# Altium schematic sheet SPI Isolator.SchDoc
size 420 x 297 mm; SheetNumber: 1; SheetTotal: 1
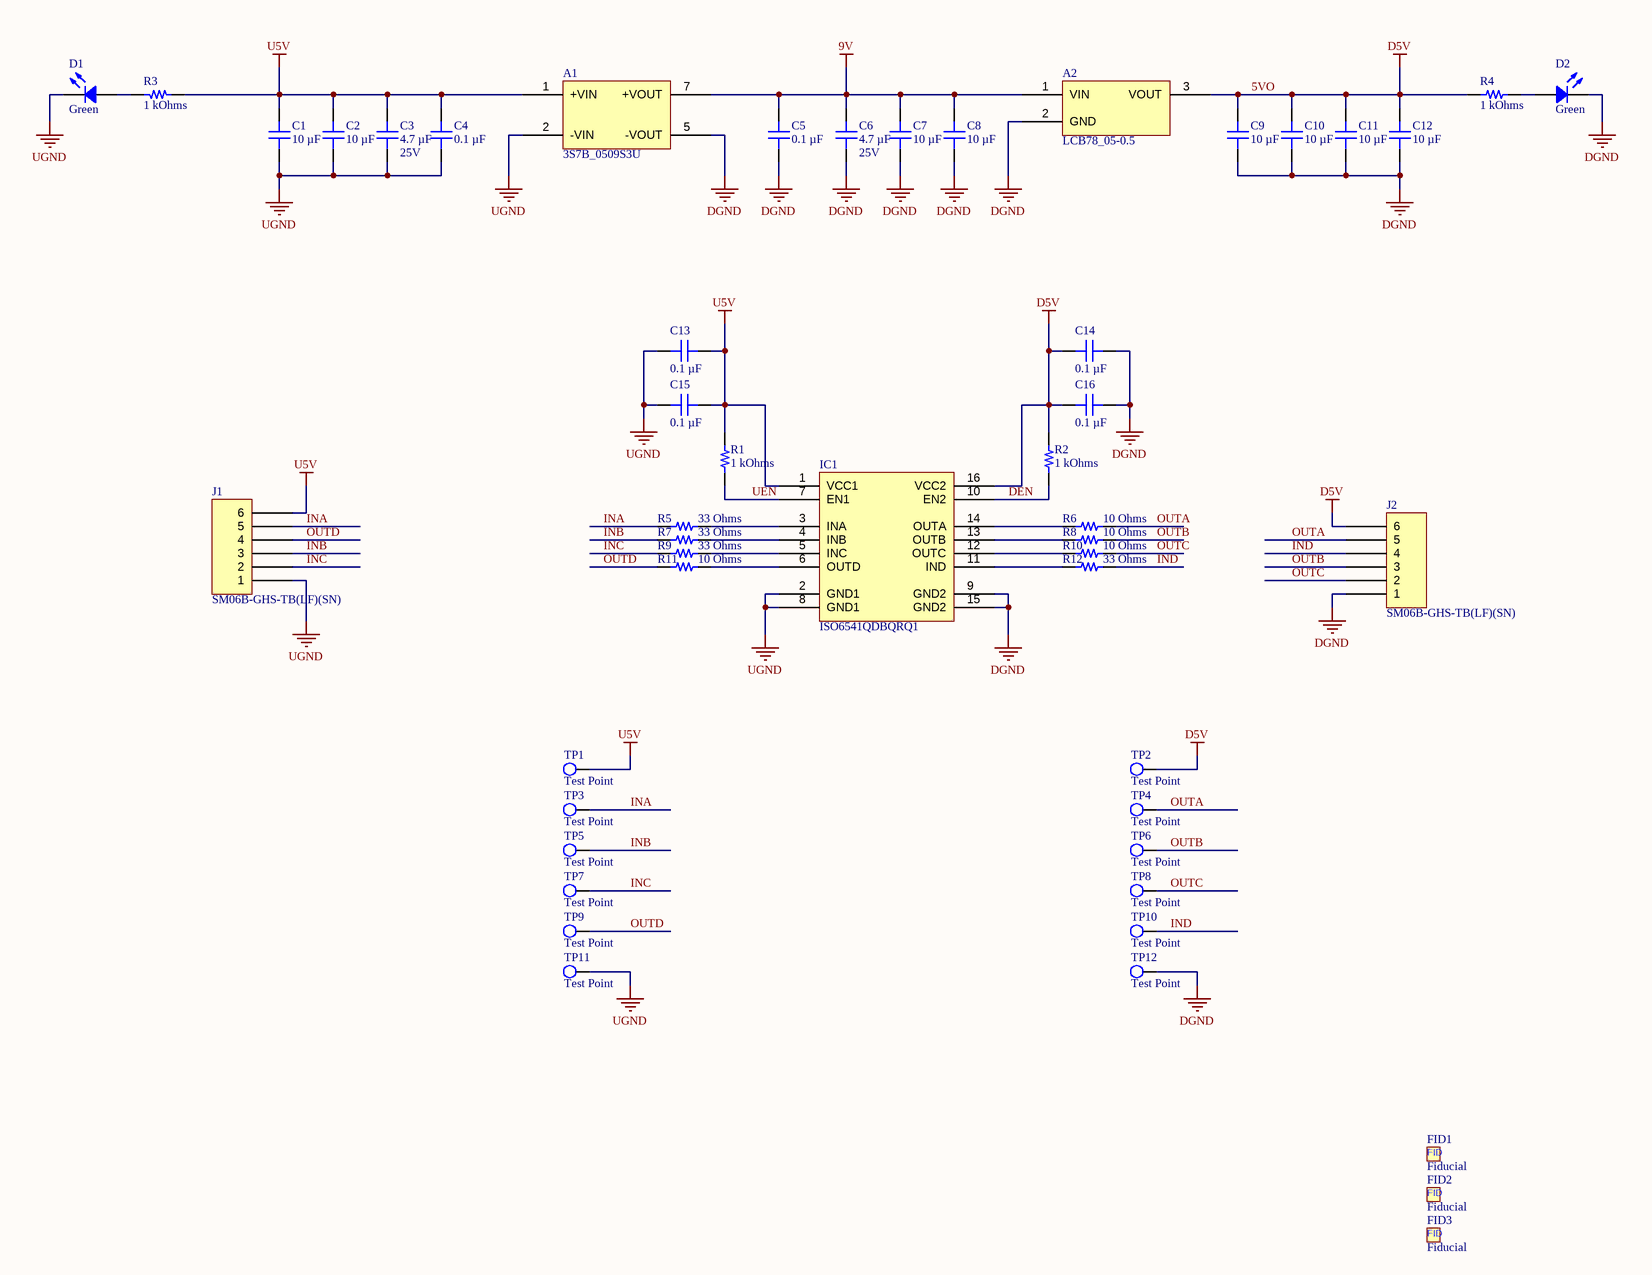
[diagram p0: SPI Isolator.SchDoc]

## Parts
A1  3S7B_0509S3U  [GAPTEC 3S7B_3U SINGLE]
A2  LCB78_05-0.5  [GAPTEC LCB78_0.5]
C1  10 µF  [CAP 1206_3216 - 0.8MM]
C2  10 µF  [CAP 1206_3216 - 0.8MM]
C3  Voltage - Rated: 25V  [MURATA GRM188 0603_1608]  (hidden comment: 4.7 µF)
C4  0.1 µF  [CAP 0603_1608]
C5  0.1 µF  [CAP 0603_1608]
C6  Voltage - Rated: 25V  [MURATA GRM188 0603_1608]  (hidden comment: 4.7 µF)
C7  10 µF  [CAP 1206_3216 - 0.8MM]
C8  10 µF  [CAP 1206_3216 - 0.8MM]
C9  10 µF  [CAP 1206_3216 - 0.8MM]
C10  10 µF  [CAP 1206_3216 - 0.8MM]
C11  10 µF  [CAP 1206_3216 - 0.8MM]
C12  10 µF  [CAP 1206_3216 - 0.8MM]
C13  0.1 µF  [CAP 0603_1608]
C14  0.1 µF  [CAP 0603_1608]
C15  0.1 µF  [CAP 0603_1608]
C16  0.1 µF  [CAP 0603_1608]
D1  Green  [LED 0603_1608 GREEN]
D2  Green  [LED 0603_1608 GREEN]
FID1  Fiducial  [Fiducial-1mm]
FID2  Fiducial  [Fiducial-1mm]
FID3  Fiducial  [Fiducial-1mm]
IC1  ISO6541QDBQRQ1  [TI SSOP-16 DBQ0016A]
J1  SM06B-GHS-TB(LF)(SN)  [JST SM06B-GHS-TB]
J2  SM06B-GHS-TB(LF)(SN)  [JST SM06B-GHS-TB]
R1  1 kOhms  [YAGEO RES 0402_1005]
R2  1 kOhms  [YAGEO RES 0402_1005]
R3  1 kOhms  [YAGEO RES 0402_1005]
R4  1 kOhms  [YAGEO RES 0402_1005]
R5  33 Ohms  [YAGEO RES 0402_1005]
R6  10 Ohms  [YAGEO RES 0402_1005]
R7  33 Ohms  [YAGEO RES 0402_1005]
R8  10 Ohms  [YAGEO RES 0402_1005]
R9  33 Ohms  [YAGEO RES 0402_1005]
R10  10 Ohms  [YAGEO RES 0402_1005]
R11  10 Ohms  [YAGEO RES 0402_1005]
R12  33 Ohms  [YAGEO RES 0402_1005]
TP1  Test Point  [TestPoint-1.5mm]  (no BOM)
TP2  Test Point  [TestPoint-1.5mm]  (no BOM)
TP3  Test Point  [TestPoint-1.5mm]  (no BOM)
TP4  Test Point  [TestPoint-1.5mm]  (no BOM)
TP5  Test Point  [TestPoint-1.5mm]  (no BOM)
TP6  Test Point  [TestPoint-1.5mm]  (no BOM)
TP7  Test Point  [TestPoint-1.5mm]  (no BOM)
TP8  Test Point  [TestPoint-1.5mm]  (no BOM)
TP9  Test Point  [TestPoint-1.5mm]  (no BOM)
TP10  Test Point  [TestPoint-1.5mm]  (no BOM)
TP11  Test Point  [TestPoint-1.5mm]  (no BOM)
TP12  Test Point  [TestPoint-1.5mm]  (no BOM)

## Nets
5VO: A2.3(VOUT) C9.2 C10.2 C11.2 C12.2 C14.2 C16.2 IC1.16(VCC2) J2.6 R2.1 R4.1 TP2.1(TP)  [also labelled D5V]
9V: A1.7(+VOUT) A2.1(VIN) C5.2 C6.2 C7.2 C8.2
DGND: A1.5(-VOUT) A2.2(GND) C5.1 C6.1 C7.1 C8.1 C9.1 C10.1 C11.1 C12.1 C14.1 C16.1 D2.2 IC1.9(GND2) IC1.15(GND2) J2.1 TP12.1(TP)
U5V: A1.1(+VIN) C1.2 C2.2 C3.2 C4.2 C13.1 C15.1 IC1.1(VCC1) J1.6 R1.1 R3.1 TP1.1(TP)
UGND: A1.2(-VIN) C1.1 C2.1 C3.1 C4.1 C13.2 C15.2 D1.2 IC1.2(GND1) IC1.8(GND1) J1.1 TP11.1(TP)
DEN: IC1.10(EN2) R2.2
INA: J1.5 R5.2 TP3.1(TP)
INB: J1.3 R7.2 TP5.1(TP)
INC: J1.2 R9.2 TP7.1(TP)
IND: J2.4 R12.1 TP10.1(TP)
OUTA: J2.5 R6.2 TP4.1(TP)
OUTB: J2.3 R8.2 TP6.1(TP)
OUTC: J2.2 R10.2 TP8.1(TP)
OUTD: J1.4 R11.1 TP9.1(TP)
UEN: IC1.7(EN1) R1.2
NetD1_1: D1.1 R3.2
NetD2_1: D2.1 R4.2
NetIC1_3: IC1.3(INA) R5.1
NetIC1_4: IC1.4(INB) R7.1
NetIC1_5: IC1.5(INC) R9.1
NetIC1_6: IC1.6(OUTD) R11.2
NetIC1_11: IC1.11(IND) R12.2
NetIC1_12: IC1.12(OUTC) R10.1
NetIC1_13: IC1.13(OUTB) R8.1
NetIC1_14: IC1.14(OUTA) R6.1

## Notes on the sheet
- THIS DOCUMENT AND THE DATA DISCLOSED HEREIN OR
- HEREWITH IS THE PROPERTY OF ORIGINAL CIRCUIT LIMITED
- DWG NO:
- REVISION
- DESCRIPTION
- DATE
- APPROVED
- AND IS STRICTLY CONFIDENTIAL.
- DO NOT DISTRIBUTE.
- DOC NO.
- ORIGINAL CIRCUIT LIMITED
- Company Number: 12070904
- TITLE
- VAT Number: GB345196095
- SIZE
- FILE
- A3
- PROJECT
- CHECKED
- SHEET
- OF
- REV
- (in symbol CMP-002-000000-1) FID

## Library data of the parts
A1 = 3S7B_0509S3U: DC-DC; Manufacturer: GAPTEC Electronic; Current - Output (Max): 333mA; Efficiency: 84%; Number of Outputs: 1; Power (Watts): 3 W; Voltage - Input (Max): 5.5V; Voltage - Input (Min): 4.5V; Voltage - Isolation: 3 kV; Voltage - Output 1: 9V; Part Number: 3S7B_0509S3U; Applications: ITE (Commercial); ComponentLink1Description: Datasheet; ComponentLink1URL: https://gaptec-electronic.com/datenblaetter/3S7B_3U.pdf; ComponentLink2Description: DigiKey Link; ComponentLink2URL: https://www.digikey.com/en/products/detail/gaptec-electronic/3S7B-0509S3U/13692545; LastUpdated: 01/09/2023 20:51:51; Lifecycle Status: Active; Minimum Order: 1; Mounting Type: Through Hole; Operating Temperature: -40°C ~ 85°C; Packaging: Tube; PartId: 72; Part Status: Active; Price: 5.05; Series: 3S7B_3U (3W); Size / Dimension: 0.77" L x 0.28" W x 0.39" H (19.6mm x 7.0mm x 10.0mm); Supplier 1: DigiKey; Supplier Part Number 1: 3182-3S7B_0509S3U-ND; Type: Isolated Module
A2 = LCB78_05-0.5: DC-DC POL; Manufacturer: GAPTEC Electronic; Current - Output (Max): 500mA; Efficiency: 95%; Number of Outputs: 1; Power (Watts): 2.5 W; Voltage - Input (Max): 55V; Voltage - Input (Min): 6.5V; Voltage - Output 1: 5V; Part Number: LCB78_05-0.5; Applications: ITE (Commercial); ComponentLink1Description: Datasheet; ComponentLink1URL: https://gaptec-electronic.com/datenblaetter/LCB78_0.5.pdf; ComponentLink2Description: DigiKey Link; ComponentLink2URL: https://www.digikey.com/en/products/detail/gaptec-electronic/LCB78-05-0-5/13691990; LastUpdated: 04/09/2023 17:37:46; Lifecycle Status: Active; Minimum Order: 1; Mounting Type: Through Hole; Operating Temperature: -40°C ~ 85°C (With Derating); Packaging: Tube; PartId: 87; Part Status: Active; Price: 5.66; Series: LCB78_0.5; Size / Dimension: 0.46" L x 0.24" W x 0.40" H (11.6mm x 6.0mm x 10.2mm); Supplier 1: DigiKey; Supplier Part Number 1: 3182-LCB78_05-0.5-ND; Type: Non-Isolated PoL Module
C1 C2 C7-C12 = CL31B106KAHNNNE: CAP CER 10UF 25V X7R 1206; manufacturer: Samsung Electro-Mechanics; Tolerance: ±10%; Part Number: CL31B106KAHNNNE; Value: 10 µF; Applications: General Purpose; Capacitance: 10 µF; componentlink1description: Datasheet; componentlink1url: http://www.samsungsem.com/kr/support/product-search/mlcc/CL31B106KAHNNNE.jsp; componentlink2description: DigiKey Link; componentlink2url: https://www.digikey.com/en/products/detail/samsung-electro-mechanics/CL31B106KAHNNNE/3887462; Device Package: 1206 (3216 Metric); lastupdated: 03/09/2023 19:14:37; Lifecycle Status: Active; Minimum Order: 1; Mounting Type: Surface Mount, MLCC; Operating Temperature: -55°C ~ 125°C; Package / Case: 1206 (3216 Metric); packaging: TapeAndReel; partid: 40754; Part Status: Active; price: 0.03; series: CL; Size / Dimension: 0.126" L x 0.063" W (3.20mm x 1.60mm); Supplier 1: DigiKey; Supplier Part Number 1: 1276-1804-1-ND; Temperature Coefficient: X7R; Thickness (Max): 0.071" (1.80mm); Voltage - Rated: 25V
C3 C6 = GRM188R61E475KE11D: CAP CER 4.7UF 25V X5R 0603; manufacturer: Murata Electronics; Tolerance: ±10%; Part Number: GRM188R61E475KE11D; Value: 4.7 µF; Applications: General Purpose; Capacitance: 4.7 µF; componentlink1description: Datasheet; componentlink1url: https://www.murata.com/~/media/webrenewal/support/library/catalog/products/capacitor/mlcc/c02e.ashx?la=en-us; componentlink2description: DigiKey Link; componentlink2url: https://www.digikey.com/en/products/detail/murata-electronics/GRM188R61E475KE11D/3900465; Device Package: 0603 (1608 Metric); lastupdated: 20/07/2024 00:23:22; Lifecycle Status: Active; Minimum Order: 1; Mounting Type: Surface Mount, MLCC; Operating Temperature: -55°C ~ 85°C; Package / Case: 0603 (1608 Metric); packaging: TapeAndReel; partid: 2387; Part Status: Active; price: 0.04; series: GRM; Size / Dimension: 0.063" L x 0.031" W (1.60mm x 0.80mm); Supplier 1: DigiKey; Supplier Part Number 1: 490-7203-1-ND; Temperature Coefficient: X5R; Thickness (Max): 0.037" (0.95mm)
C4 C5 C13-C16 = CL10B104KB8NNNC: CAP CER 0.1UF 50V X7R 0603; manufacturer: Samsung Electro-Mechanics; Tolerance: ±10%; Part Number: CL10B104KB8NNNC; Value: 0.1 µF; Applications: General Purpose; Capacitance: 0.1 µF; componentlink1description: Datasheet; componentlink1url: http://www.samsungsem.com/kr/support/product-search/mlcc/CL10B104KB8NNNC.jsp; componentlink2description: DigiKey Link; componentlink2url: https://www.digikey.com/en/products/detail/samsung-electro-mechanics/CL10B104KB8NNNC/3886658; Device Package: 0603 (1608 Metric); lastupdated: 20/08/2023 19:09:00; Lifecycle Status: Active; Minimum Order: 1; Mounting Type: Surface Mount, MLCC; Operating Temperature: -55°C ~ 125°C; Package / Case: 0603 (1608 Metric); packaging: TapeAndReel; partid: 9788; Part Status: Active; price: 0.01; series: CL; Size / Dimension: 0.063" L x 0.031" W (1.60mm x 0.80mm); Supplier 1: DigiKey; Supplier Part Number 1: 1276-1000-1-ND; Temperature Coefficient: X7R; Thickness (Max): 0.035" (0.90mm); Voltage - Rated: 50V
D1 D2 = LG Q976.01-MGNI-35-1: LED GREEN CLEAR 0603 SMD; Manufacturer: ams-OSRAM USA Inc.; Current - Test: 20mA; Lens Color: Colorless; Lens Size: 1.10mm x 0.80mm; Lens Style: Rectangle with Flat Top; Millicandela Rating: 31.5mcd; Viewing Angle: 140°; Voltage - Forward (Vf) (Typ): 2V; Wavelength - Dominant: 574nm; Part Number: LG Q976.01-MGNI-35-1; Color: Green; ComponentLink2Description: DigiKey Link; ComponentLink2URL: https://www.digikey.com/en/products/detail/ams-osram-usa-inc/LG-Q976-01-MGNI-35-1/21556493; Device Package: 0603 (1608 Metric); Height (Max): 0.75mm; LastUpdated: 03/06/2024 19:58:39; Lens Transparency: Clear; Lifecycle Status: Active; Minimum Order: 1; Mounting Type: Surface Mount; Package / Case: 0603 (1608 Metric); Packaging: TapeAndReel; PartId: 1447; Price: 0.02; Series: LO Q976.01; Size / Dimension: 1.60mm L x 0.80mm W; Supplier 1: DigiKey; Supplier Part Number 1: 475-LGQ976.01-MGNI-35-1CT-ND; Supplier Device Package: 0603; Value: Green; Wavelength - Peak: 574nm
FID1-FID3 = CMP-002-000000-1: Design Item ID: Fiducial; Component Type: Standard; Source: Fiducial.SchLib; Pin Count: 0
IC1 = ISO6541QDBQRQ1: AUTOMOTIVE, 100-V ISOLATION; Manufacturer: Texas Instruments; Channel Type: Unidirectional; Common Mode Transient Immunity (Min): 100kV/µs; Data Rate: 50Mbps; Inputs - Side 1/Side 2: 3/1; Isolated Power: Yes; Number of Channels: 4; Propagation Delay tpLH / tpHL (Max): 18ns, 18ns; Pulse Width Distortion (Max): 7ns; Rise / Fall Time (Typ): 2.6ns, 2.6ns; Voltage - Isolation: 707Vrms; Voltage - Supply: 1.71V ~ 1.89V, 2.25V ~ 5.5V; Part Number: ISO6541QDBQRQ1; ComponentLink1Description: Datasheet; ComponentLink1URL: https://www.ti.com/lit/ds/symlink/iso6521-q1.pdf?ts=1748606133465&ref_url=https%253A%252F%252Fwww.ti.com%252Fproduct%252FISO6521-Q1%252Fpart-details%252FISO6521FQDRQ1; ComponentLink2Description: DigiKey Link; ComponentLink2URL: https://www.digikey.com/en/products/detail/texas-instruments/ISO6541QDBQRQ1/26692274; LastUpdated: 15/07/2025 15:42:45; Lifecycle Status: Active; Minimum Order: 1; Mounting Type: Surface Mount; Operating Temperature: -40°C ~ 125°C; Packaging: TapeAndReel; PartId: 50; Price: 0.70; Series: -; Supplier 1: DigiKey; Supplier Part Number 1: 296-ISO6541QDBQRQ1CT-ND; Supplier Device Package: 16-SSOP; Technology: Capacitive Coupling; Type: CAN, SPI
J1 J2 = SM06B-GHS-TB(LF)(SN): CONN HEADER SMD R/A 6POS 1.25MM; Manufacturer: JST Sales America Inc.; Current Rating (Amps): 1A; Material Flammability Rating: UL94 V-0; Number of Positions: 6; Number of Positions Loaded: All; Pitch - Mating: 0.049" (1.25mm); Shrouding: Shrouded - 4 Wall; Style: Board to Cable/Wire; Voltage Rating: 50V; Part Number: SM06B-GHS-TB(LF)(SN); ComponentLink1Description: Datasheet; ComponentLink1URL: http://www.jst-mfg.com/product/pdf/eng/eGH.pdf; ComponentLink2Description: DigiKey Link; ComponentLink2URL: http://digikey.com/product-detail/en/jst-sales-america-inc/SM06B-GHS-TB-LF-SN/455-1568-1-ND/807836; Connector Type: Header; Contact Finish - Mating: Tin; Contact Finish - Post: Tin; Contact Material: Phosphor Bronze; Contact Shape: Rectangular; Contact Type: Outer Shroud Contact; Fastening Type: Locking Ramp; Features: Solder Retention; Insulation Color: Natural; Insulation Height: 0.167" (4.25mm); Insulation Material: Polyamide (PA9T), Nylon 9T; LastUpdated: 12/01/2020 23:38:11; Lifecycle Status: Active; Minimum Order: 1; Mounting Type: Surface Mount, Right Angle; Number of Rows: 1; Operating Temperature: -25°C ~ 85°C; Packaging: TapeAndReel; PartId: 57; Part Status: Active; Price: 0.25; Series: GH; Supplier 1: DigiKey; Supplier Part Number 1: 455-1568-1-ND; Termination: Solder
R1-R4 = RC0402FR-071KP: RES 1K OHM 1% 1/16W 0402; Manufacturer: Yageo; Power (Watts): 0.063W, 1/16W; Ratings: 7C1 RoHS w/out Exemption (100% Pb-Free); Temperature Coefficient: ±100ppm/°C; Part Number: RC0402FR-071KP; Value: 1 kOhms; ComponentLink1Description: Datasheet; ComponentLink1URL: http://www.yageo.com/NewPortal/yageodocoutput?fileName=/pdf/R-Chip/PYu-RC_51_RoHS_P_0.pdf; ComponentLink2Description: DigiKey Link; ComponentLink2URL: https://www.digikey.com/en/products/detail/yageo/RC0402FR-071KP/4935269; Composition: Thick Film; Device Package: 0402 (1005 Metric); Features: Moisture Resistant; Height - Seated (Max): 0.016" (0.40mm); LastUpdated: 25/07/2024 09:18:12; Lifecycle Status: Active; Minimum Order: 1; Number of Terminations: 2; Operating Temperature: -55°C ~ 155°C; Package / Case: 0402 (1005 Metric); Packaging: CutTape; PartId: 16161; Part Status: Active; Price: 0.01; Resistance: 1 kOhms; Series: RC_P; Size / Dimension: 0.039" L x 0.020" W (1.00mm x 0.50mm); Supplier 1: DigiKey; Supplier Part Number 1: YAG1254CT-ND; Supplier Device Package: 0402; Tolerance: ±1%
R5 R7 R9 R12 = RC0402FR-0733RP: RES 33 OHM 1% 1/16W 0402; Manufacturer: Yageo; Power (Watts): 0.063W, 1/16W; Ratings: 7C1 RoHS w/out Exemption (100% Pb-Free); Temperature Coefficient: ±100ppm/°C; Part Number: RC0402FR-0733RP; Value: 33 Ohms; ComponentLink1Description: Datasheet; ComponentLink1URL: http://www.yageo.com/NewPortal/yageodocoutput?fileName=/pdf/R-Chip/PYu-RC_51_RoHS_P_0.pdf; ComponentLink2Description: DigiKey Link; ComponentLink2URL: https://www.digikey.com/en/products/detail/yageo/RC0402FR-0733RP/4935279; Composition: Thick Film; Device Package: 0402 (1005 Metric); Features: Moisture Resistant; Height - Seated (Max): 0.016" (0.40mm); LastUpdated: 25/07/2024 09:18:15; Lifecycle Status: Active; Minimum Order: 1; Number of Terminations: 2; Operating Temperature: -55°C ~ 155°C; Package / Case: 0402 (1005 Metric); Packaging: CutTape; PartId: 9331; Part Status: Active; Price: 0.01; Resistance: 33 Ohms; Series: RC_P; Size / Dimension: 0.039" L x 0.020" W (1.00mm x 0.50mm); Supplier 1: DigiKey; Supplier Part Number 1: YAG1264CT-ND; Supplier Device Package: 0402; Tolerance: ±1%
R6 R8 R10 R11 = RC0402FR-1310RL: RES 10 OHM 1% 1/16W 0402; Manufacturer: Yageo; Power (Watts): 0.063W, 1/16W; Temperature Coefficient: ±200ppm/°C; Part Number: RC0402FR-1310RL; Value: 10 Ohms; ComponentLink1Description: Datasheet; ComponentLink1URL: https://www.yageo.com/upload/media/product/productsearch/datasheet/rchip/PYu-RC_Group_51_RoHS_L_11.pdf; ComponentLink2Description: DigiKey Link; ComponentLink2URL: https://www.digikey.com/en/products/detail/yageo/RC0402FR-1310RL/13694088; Composition: Thick Film; Device Package: 0402 (1005 Metric); Features: Moisture Resistant; Height - Seated (Max): 0.016" (0.40mm); LastUpdated: 25/07/2024 09:18:04; Lifecycle Status: Active; Minimum Order: 1; Number of Terminations: 2; Operating Temperature: -55°C ~ 155°C; Package / Case: 0402 (1005 Metric); Packaging: CutTape; PartId: 64947; Part Status: Active; Price: 0.01; Resistance: 10 Ohms; Series: RC_L; Size / Dimension: 0.039" L x 0.020" W (1.00mm x 0.50mm); Supplier 1: DigiKey; Supplier Part Number 1: 13-RC0402FR-1310RLCT-ND; Supplier Device Package: 0402; Tolerance: ±1%
TP1-TP12 = CMP-003-000000-1: Component Type: Standard (No BOM); Source: Test Point.SchLib; Design Item ID: Test Point; Pin Count: 1